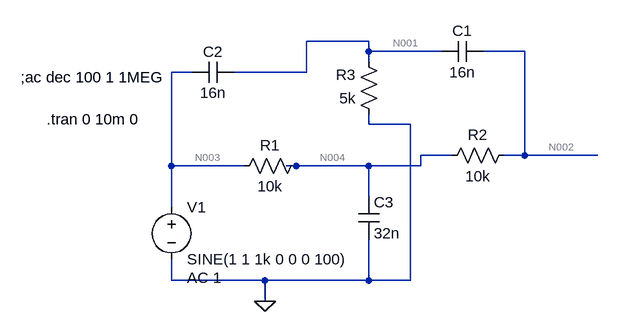
[diagram p0: schematic filter.asc]
filter.asc, the LTspice schematic file:
Version 4
SHEET 1 880 680
WIRE 288 -128 192 -128
WIRE 288 -112 288 -128
WIRE 400 -112 288 -112
WIRE 528 -112 464 -112
WIRE 288 -96 288 -112
WIRE 16 -80 -16 -80
WIRE 192 -80 192 -128
WIRE 192 -80 80 -80
WIRE 288 0 288 -16
WIRE 352 0 288 0
WIRE 416 48 368 48
WIRE 528 48 528 -112
WIRE 528 48 496 48
WIRE 640 48 528 48
WIRE -16 64 -16 -80
WIRE 96 64 -16 64
WIRE 176 64 160 64
WIRE 288 64 176 64
WIRE 368 64 368 48
WIRE 368 64 288 64
WIRE 288 112 288 64
WIRE -16 128 -16 64
WIRE -16 240 -16 208
WIRE 128 240 -16 240
WIRE 288 240 288 176
WIRE 288 240 128 240
WIRE 352 240 352 0
WIRE 352 240 288 240
WIRE 128 272 128 240
FLAG 128 272 0
SYMBOL voltage -16 112 R0
WINDOW 123 24 124 Left 2
WINDOW 39 0 0 Left 2
SYMATTR InstName V1
SYMATTR Value SINE(1 1 1k 0 0 0 100)
SYMATTR Value2 AC 1
SYMBOL res 512 32 R90
WINDOW 0 0 56 VBottom 2
WINDOW 3 32 56 VTop 2
SYMATTR InstName R2
SYMATTR Value 10k
SYMBOL res 192 48 R90
WINDOW 0 0 56 VBottom 2
WINDOW 3 32 56 VTop 2
SYMATTR InstName R1
SYMATTR Value 10k
SYMBOL res 304 0 R180
WINDOW 0 36 76 Left 2
WINDOW 3 36 40 Left 2
SYMATTR InstName R3
SYMATTR Value 5k
SYMBOL cap 464 -128 R90
WINDOW 0 0 32 VBottom 2
WINDOW 3 32 32 VTop 2
SYMATTR InstName C1
SYMATTR Value 16n
SYMBOL cap 80 -96 R90
WINDOW 0 0 32 VBottom 2
WINDOW 3 32 32 VTop 2
SYMATTR InstName C2
SYMATTR Value 16n
SYMBOL cap 272 112 R0
SYMATTR InstName C3
SYMATTR Value 32n
TEXT -248 -72 Left 2 !;ac dec 100 1 1MEG
TEXT -208 -8 Left 2 !.tran 0 10m 0

The netlist it stands for:
* filter.asc
V1 N003 0 SINE(1 1 1k 0 0 0 100) AC 1
R2 N002 N004 10k
R1 N004 N003 10k
R3 0 N001 5k
C1 N002 N001 16n
C2 N001 N003 16n
C3 N004 0 32n
;ac dec 100 1 1MEG
.tran 0 10m 0
.backanno
.end

* Results of the author's LTspice run, read from the files saved beside the schematic
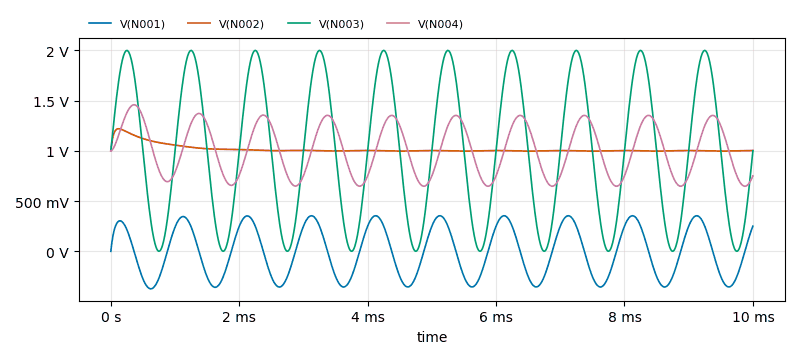
[diagram p1: Transient Analysis of filter.asc, plotted from the saved traces]
* Transient Analysis, 1 run:
*   V(N001): min -372.6 mV, max 354.1 mV, average -4.053 mV, rms 249 mV, last 250.7 mV
*   V(N002): min 997.2 mV, max 1.219 V, average 1.016 V, rms 1.017 V, last 1.003 V
*   V(N003): min 955.9 µV, max 1.999 V, average 999.8 mV, rms 1.224 V, last 1 V
*   V(N004): min 647.8 mV, max 1.458 V, average 1.012 V, rms 1.043 V, last 750.7 mV